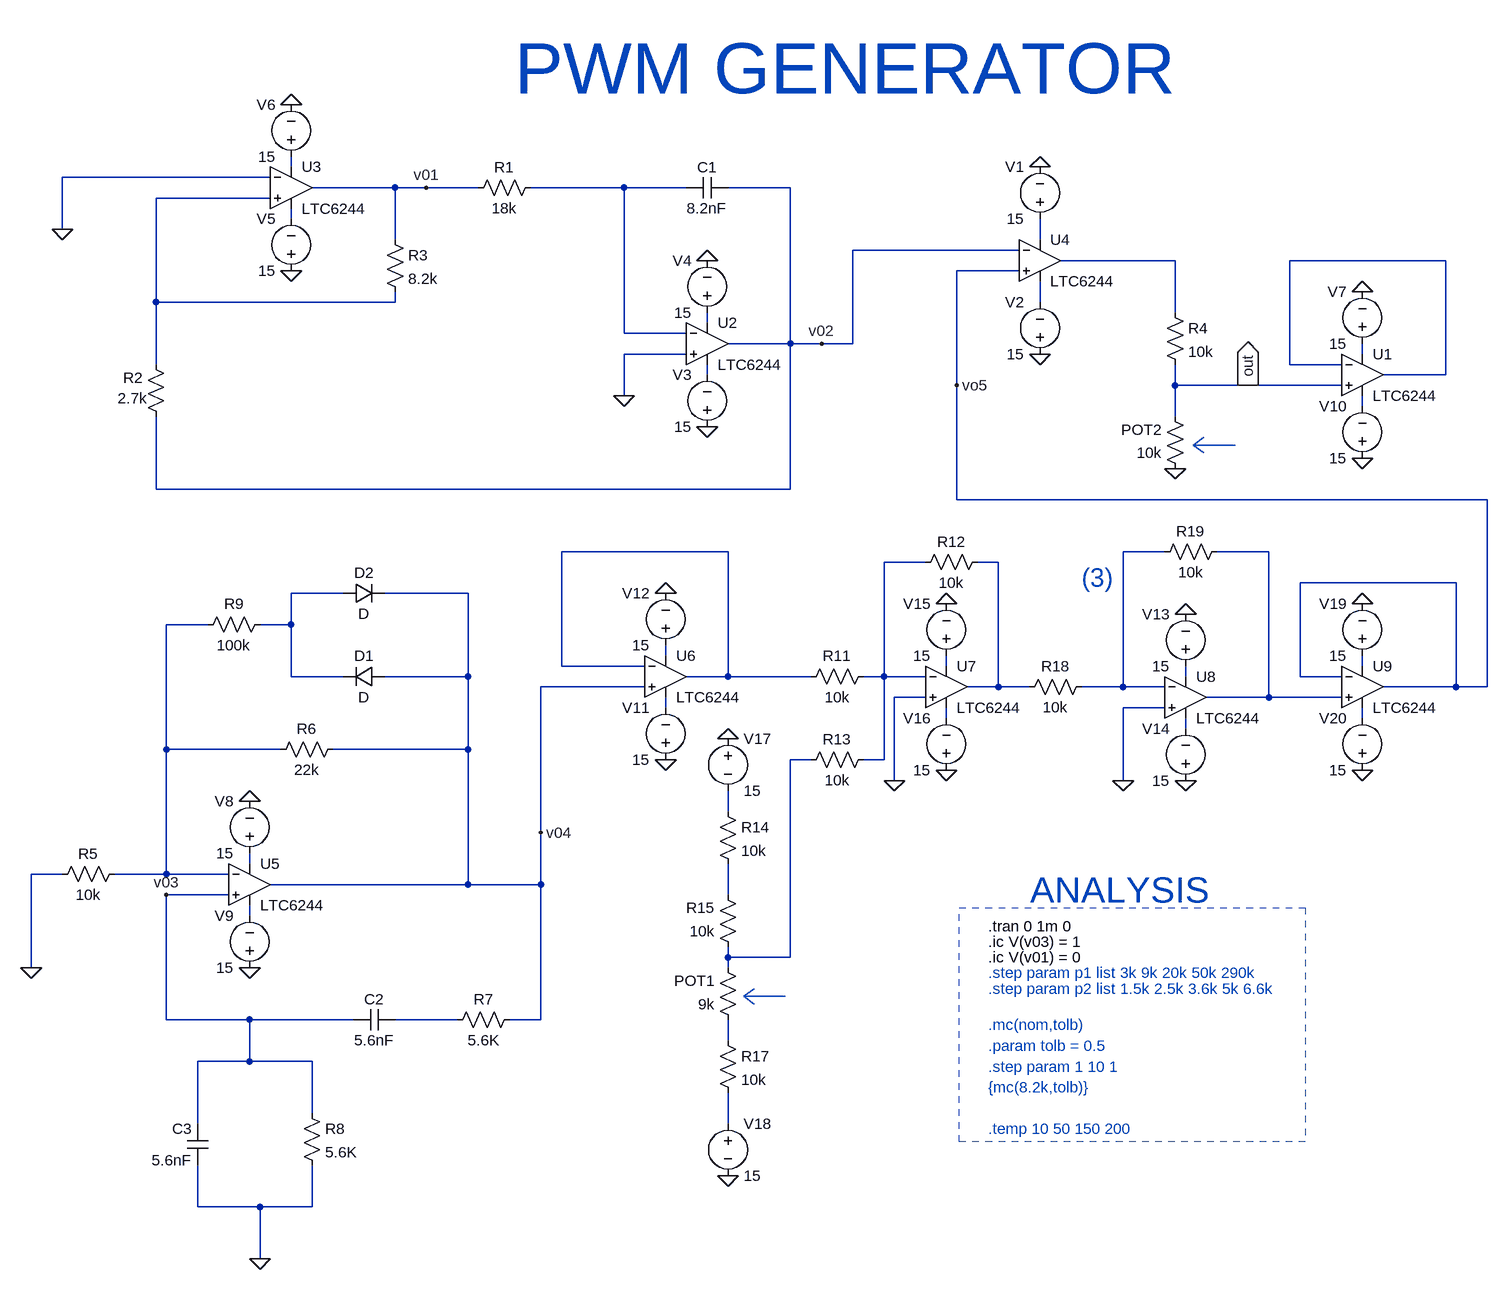
[diagram p0: schematic CAD_project_Istrate_Andreea.asc]
CAD_project_Istrate_Andreea.asc, the LTspice schematic file:
Version 4
SHEET 1 3412 2608
WIRE 352 -144 352 -160
WIRE 320 -128 0 -128
WIRE 512 -112 384 -112
WIRE 560 -112 512 -112
WIRE 640 -112 560 -112
WIRE 864 -112 720 -112
WIRE 960 -112 864 -112
WIRE 1120 -112 1024 -112
WIRE 320 -96 144 -96
WIRE 352 -64 352 -80
WIRE 0 -48 0 -128
WIRE 512 -32 512 -112
WIRE 1504 -32 1504 -64
WIRE 1472 -16 1216 -16
WIRE 1712 0 1536 0
WIRE 2128 0 1888 0
WIRE 1472 16 1376 16
WIRE 144 64 144 -96
WIRE 512 64 512 48
WIRE 512 64 144 64
WIRE 1504 64 1504 32
WIRE 1712 80 1712 0
WIRE 992 96 992 80
WIRE 864 112 864 -112
WIRE 960 112 864 112
WIRE 1120 128 1120 -112
WIRE 1120 128 1024 128
WIRE 1168 128 1120 128
WIRE 1216 128 1216 -16
WIRE 1216 128 1168 128
WIRE 960 144 864 144
WIRE 2000 144 2000 128
WIRE 144 160 144 64
WIRE 1888 160 1888 0
WIRE 1968 160 1888 160
WIRE 992 176 992 160
WIRE 2128 176 2128 0
WIRE 2128 176 2032 176
WIRE 1376 192 1376 16
WIRE 1712 192 1712 160
WIRE 1824 192 1712 192
WIRE 1968 192 1824 192
WIRE 864 208 864 144
WIRE 2000 224 2000 208
WIRE 1712 240 1712 192
WIRE 144 352 144 240
WIRE 1120 352 1120 128
WIRE 1120 352 144 352
WIRE 1376 368 1376 192
WIRE 2192 368 1376 368
WIRE 1024 448 768 448
WIRE 1696 448 1632 448
WIRE 1856 448 1776 448
WIRE 1328 464 1264 464
WIRE 1440 464 1408 464
WIRE 2144 496 1904 496
WIRE 432 512 352 512
WIRE 624 512 496 512
WIRE 224 560 160 560
WIRE 352 560 352 512
WIRE 352 560 304 560
WIRE 928 608 928 592
WIRE 768 624 768 448
WIRE 896 624 768 624
WIRE 1360 624 1360 608
WIRE 2000 624 2000 608
WIRE 352 640 352 560
WIRE 432 640 352 640
WIRE 624 640 624 512
WIRE 624 640 496 640
WIRE 1024 640 1024 448
WIRE 1024 640 960 640
WIRE 1152 640 1024 640
WIRE 1264 640 1264 464
WIRE 1264 640 1232 640
WIRE 1328 640 1264 640
WIRE 1728 640 1728 624
WIRE 1904 640 1904 496
WIRE 1968 640 1904 640
WIRE 896 656 736 656
WIRE 1440 656 1440 464
WIRE 1440 656 1392 656
WIRE 1488 656 1440 656
WIRE 1632 656 1632 448
WIRE 1632 656 1568 656
WIRE 1696 656 1632 656
WIRE 2144 656 2144 496
WIRE 2144 656 2032 656
WIRE 2192 656 2192 368
WIRE 2192 656 2144 656
WIRE 1328 672 1280 672
WIRE 1856 672 1856 448
WIRE 1856 672 1760 672
WIRE 1968 672 1856 672
WIRE 928 688 928 672
WIRE 1696 688 1632 688
WIRE 1360 704 1360 688
WIRE 2000 704 2000 688
WIRE 1728 720 1728 704
WIRE 160 752 160 560
WIRE 336 752 160 752
WIRE 624 752 624 640
WIRE 624 752 416 752
WIRE 1152 768 1120 768
WIRE 1264 768 1264 640
WIRE 1264 768 1232 768
WIRE 1280 800 1280 672
WIRE 1632 800 1632 688
WIRE 1024 848 1024 816
WIRE 736 880 736 656
WIRE 288 928 288 912
WIRE 0 944 -48 944
WIRE 160 944 160 752
WIRE 160 944 80 944
WIRE 256 944 160 944
WIRE 624 960 624 752
WIRE 624 960 320 960
WIRE 736 960 736 880
WIRE 736 960 624 960
WIRE 256 976 160 976
WIRE 1024 976 1024 928
WIRE 288 1008 288 992
WIRE 1024 1072 1024 1056
WIRE 1120 1072 1120 768
WIRE 1120 1072 1024 1072
WIRE -48 1088 -48 944
WIRE 1024 1088 1024 1072
WIRE 160 1168 160 976
WIRE 288 1168 160 1168
WIRE 448 1168 288 1168
WIRE 608 1168 512 1168
WIRE 736 1168 736 960
WIRE 736 1168 688 1168
WIRE 1024 1200 1024 1168
WIRE 288 1232 288 1168
WIRE 288 1232 208 1232
WIRE 384 1232 288 1232
WIRE 384 1312 384 1232
WIRE 208 1328 208 1232
WIRE 1024 1328 1024 1280
WIRE 208 1456 208 1392
WIRE 304 1456 208 1456
WIRE 384 1456 384 1392
WIRE 384 1456 304 1456
WIRE 304 1536 304 1456
FLAG 1504 144 0
FLAG 1504 -144 0
FLAG 1824 192 out
IOPIN 1824 192 Out
FLAG 304 1536 0
FLAG -48 1088 0
FLAG 288 1088 0
FLAG 288 832 0
FLAG 0 -48 0
FLAG 352 16 0
FLAG 352 -240 0
FLAG 992 0 0
FLAG 992 256 0
FLAG 1712 320 0
FLAG 560 -112 v01
FLAG 2000 304 0
FLAG 2000 48 0
FLAG 928 768 0
FLAG 928 512 0
FLAG 1360 784 0
FLAG 1360 528 0
FLAG 1728 800 0
FLAG 1728 544 0
FLAG 1632 800 0
FLAG 1280 800 0
FLAG 1024 1408 0
FLAG 1024 736 0
FLAG 2000 784 0
FLAG 2000 528 0
FLAG 864 208 0
FLAG 160 976 v03
FLAG 1168 128 v02
FLAG 736 880 v04
FLAG 1376 192 vo5
SYMBOL voltage 1504 -48 R180
WINDOW 0 24 96 Left 2
WINDOW 3 24 16 Left 2
SYMATTR InstName V1
SYMATTR Value 15
SYMBOL voltage 1504 160 R180
WINDOW 0 24 96 Left 2
WINDOW 3 24 16 Left 2
SYMATTR InstName V2
SYMATTR Value 15
SYMBOL Voltage 288 928 R180
WINDOW 0 24 96 Left 2
WINDOW 3 24 16 Left 2
SYMATTR InstName V8
SYMATTR Value 15
SYMBOL Voltage 288 1104 R180
WINDOW 0 24 96 Left 2
WINDOW 3 24 16 Left 2
SYMATTR InstName V9
SYMATTR Value 15
SYMBOL Res 96 928 R90
WINDOW 0 0 56 VBottom 2
WINDOW 3 32 56 VTop 2
SYMATTR InstName R5
SYMATTR Value 10k
SYMBOL Res 432 736 R90
WINDOW 0 0 56 VBottom 2
WINDOW 3 32 56 VTop 2
SYMATTR InstName R6
SYMATTR Value 22k
SYMBOL Res 704 1152 R90
WINDOW 0 0 56 VBottom 2
WINDOW 3 32 56 VTop 2
SYMATTR InstName R7
SYMATTR Value 5.6K
SYMBOL Cap 512 1152 R90
WINDOW 0 0 32 VBottom 2
WINDOW 3 32 32 VTop 2
SYMATTR InstName C2
SYMATTR Value 5.6nF
SYMBOL Cap 224 1328 M0
SYMATTR InstName C3
SYMATTR Value 5.6nF
SYMBOL Res 368 1296 R0
SYMATTR InstName R8
SYMATTR Value 5.6K
SYMBOL Voltage 992 272 R180
WINDOW 0 24 96 Left 2
WINDOW 3 24 16 Left 2
SYMATTR InstName V3
SYMATTR Value 15
SYMBOL Voltage 992 96 R180
WINDOW 0 24 96 Left 2
WINDOW 3 24 16 Left 2
SYMATTR InstName V4
SYMATTR Value 15
SYMBOL Voltage 352 32 R180
WINDOW 0 24 96 Left 2
WINDOW 3 24 16 Left 2
SYMATTR InstName V5
SYMATTR Value 15
SYMBOL Voltage 352 -144 R180
WINDOW 0 24 96 Left 2
WINDOW 3 24 16 Left 2
SYMATTR InstName V6
SYMATTR Value 15
SYMBOL Res 160 256 R180
WINDOW 0 36 76 Left 2
WINDOW 3 29 44 Left 2
SYMATTR InstName R2
SYMATTR Value 2.7k
SYMBOL Res 496 -48 R0
SYMATTR InstName R3
SYMATTR Value 8.2k
SYMBOL Cap 1024 -128 R90
WINDOW 0 0 32 VBottom 2
WINDOW 3 32 32 VTop 2
SYMATTR InstName C1
SYMATTR Value 8.2nF
SYMBOL Res 1728 336 R180
WINDOW 0 36 76 Left 2
WINDOW 3 36 40 Left 2
SYMATTR InstName POT2
SYMATTR Value 10k
SYMBOL Res 1696 64 R0
SYMATTR InstName R4
SYMATTR Value 10k
SYMBOL Opamps/LTC6244 992 128 R0
SYMATTR InstName U2
SYMBOL Opamps/LTC6244 352 -112 R0
SYMATTR InstName U3
SYMBOL Opamps/LTC6244 1504 0 R0
SYMATTR InstName U4
SYMBOL Res 320 544 R90
WINDOW 0 0 56 VBottom 2
WINDOW 3 32 56 VTop 2
SYMATTR InstName R9
SYMATTR Value 100k
SYMBOL Diode 496 624 R90
WINDOW 0 0 32 VBottom 2
WINDOW 3 32 32 VTop 2
SYMATTR InstName D1
SYMBOL Diode 432 528 R270
WINDOW 0 32 32 VTop 2
WINDOW 3 0 32 VBottom 2
SYMATTR InstName D2
SYMBOL Opamps/LTC6244 288 960 R0
SYMATTR InstName U5
SYMBOL Opamps/LTC6244 2000 176 R0
SYMATTR InstName U1
SYMBOL Voltage 2000 144 R180
WINDOW 0 24 96 Left 2
WINDOW 3 24 16 Left 2
SYMATTR InstName V7
SYMATTR Value 15
SYMBOL Voltage 2000 320 R180
WINDOW 0 24 96 Left 2
WINDOW 3 24 16 Left 2
SYMATTR InstName V10
SYMATTR Value 15
SYMBOL Opamps/LTC6244 928 640 R0
SYMATTR InstName U6
SYMBOL Opamps/LTC6244 1360 656 R0
SYMATTR InstName U7
SYMBOL Opamps/LTC6244 1728 672 R0
SYMATTR InstName U8
SYMBOL Voltage 928 784 R180
WINDOW 0 24 96 Left 2
WINDOW 3 24 16 Left 2
SYMATTR InstName V11
SYMATTR Value 15
SYMBOL Voltage 928 608 R180
WINDOW 0 24 96 Left 2
WINDOW 3 24 16 Left 2
SYMATTR InstName V12
SYMATTR Value 15
SYMBOL Voltage 1728 640 R180
WINDOW 0 24 96 Left 2
WINDOW 3 24 16 Left 2
SYMATTR InstName V13
SYMATTR Value 15
SYMBOL Voltage 1728 816 R180
WINDOW 0 24 96 Left 2
WINDOW 3 24 16 Left 2
SYMATTR InstName V14
SYMATTR Value 15
SYMBOL Voltage 1360 624 R180
WINDOW 0 24 96 Left 2
WINDOW 3 24 16 Left 2
SYMATTR InstName V15
SYMATTR Value 15
SYMBOL Voltage 1360 800 R180
WINDOW 0 24 96 Left 2
WINDOW 3 24 16 Left 2
SYMATTR InstName V16
SYMATTR Value 15
SYMBOL Res 1248 624 R90
WINDOW 0 0 56 VBottom 2
WINDOW 3 32 56 VTop 2
SYMATTR InstName R11
SYMATTR Value 10k
SYMBOL Res 1424 448 R90
WINDOW 0 0 56 VBottom 2
WINDOW 3 32 56 VTop 2
SYMATTR InstName R12
SYMATTR Value 10k
SYMBOL Res 1248 752 R90
WINDOW 0 0 56 VBottom 2
WINDOW 3 32 56 VTop 2
SYMATTR InstName R13
SYMATTR Value 10k
SYMBOL Res 1040 1072 R180
WINDOW 0 36 76 Left 2
WINDOW 3 36 40 Left 2
SYMATTR InstName R15
SYMATTR Value 10k
SYMBOL Res 1040 1184 R180
WINDOW 0 36 76 Left 2
WINDOW 3 36 40 Left 2
SYMATTR InstName POT1
SYMATTR Value 9k
SYMBOL Voltage 1024 720 R0
SYMATTR InstName V17
SYMATTR Value 15
SYMBOL Voltage 1024 1312 R0
SYMATTR InstName V18
SYMATTR Value 15
SYMBOL Res 1584 640 R90
WINDOW 0 0 56 VBottom 2
WINDOW 3 32 56 VTop 2
SYMATTR InstName R18
SYMATTR Value 10k
SYMBOL Res 1792 432 R90
WINDOW 0 0 56 VBottom 2
WINDOW 3 32 56 VTop 2
SYMATTR InstName R19
SYMATTR Value 10k
SYMBOL Opamps/LTC6244 2000 656 R0
SYMATTR InstName U9
SYMBOL Voltage 2000 624 R180
WINDOW 0 24 96 Left 2
WINDOW 3 24 16 Left 2
SYMATTR InstName V19
SYMATTR Value 15
SYMBOL Voltage 2000 800 R180
WINDOW 0 24 96 Left 2
WINDOW 3 24 16 Left 2
SYMATTR InstName V20
SYMATTR Value 15
SYMBOL Res 1008 832 R0
SYMATTR InstName R14
SYMATTR Value 10k
SYMBOL Res 1008 1184 R0
SYMATTR InstName R17
SYMATTR Value 10k
SYMBOL Res 736 -128 R90
WINDOW 0 0 56 VBottom 2
WINDOW 3 32 56 VTop 2
SYMATTR InstName R1
SYMATTR Value 18k
TEXT 1424 1024 Left 2 !.tran 0 1m 0
TEXT 1760 968 Right 5 ;ANALYSIS
TEXT 1424 1120 Left 2 ;.step param p2 list 1.5k 2.5k 3.6k 5k 6.6k
TEXT 696 -296 Left 7 ;PWM GENERATOR
TEXT 1424 1176 Left 2 ;.mc(nom,tolb)
TEXT 1424 1208 Left 2 ;.param tolb = 0.5
TEXT 1424 1240 Left 2 ;.step param 1 10 1
TEXT 1424 1272 Left 2 ;{mc(8.2k,tolb)}
TEXT 1424 1336 Left 2 ;.temp 10 50 150 200
TEXT 1424 1048 Left 2 !.ic V(v03) = 1
TEXT 1424 1072 Left 2 !.ic V(v01) = 0
TEXT 1424 1096 Left 2 ;.step param p1 list 3k 9k 20k 50k 290k
TEXT 1568 488 Left 4 ;(3)
LINE Normal 1804 284 1740 284
LINE Normal 1756 272 1740 284
LINE Normal 1740 284 1756 296
LINE Normal 1112 1132 1048 1132
LINE Normal 1064 1120 1048 1132
LINE Normal 1048 1132 1064 1144
RECTANGLE Normal 1380 996 1912 1356 2

The netlist it stands for:
* CAD_project_Istrate_Andreea.asc
V1 N005 0 15
V2 0 N008 15
V8 N030 0 15
V9 0 N032 15
R5 N019 0 10k
R6 v04 N019 22k
R7 v04 N033 5.6K
C2 N033 v03 5.6nF
C3 v03 0 5.6nF
R8 v03 0 5.6K
V3 0 N011 15
V4 N009 0 15
V5 0 N004 15
V6 N001 0 15
R2 v02 N003 2.7k
R3 v01 N003 8.2k
C1 v02 N002 8.2nF
R§POT2 0 out 10k
R4 N006 out 10k
XU2 0 N002 N009 N011 v02 LTC6244  ; pins In+ In- V+ V- OUT
XU3 N003 0 N001 N004 v01 LTC6244  ; pins In+ In- V+ V- OUT
XU4 vo5 v02 N005 N008 N006 LTC6244  ; pins In+ In- V+ V- OUT
R9 N018 N019 100k
D1 v04 N018 D
D2 N018 v04 D
XU5 v03 N019 N030 N032 v04 LTC6244  ; pins In+ In- V+ V- OUT
XU1 out N007 N010 N012 N007 LTC6244  ; pins In+ In- V+ V- OUT
V7 N010 0 15
V10 0 N012 15
XU6 v04 N013 N020 N024 N013 LTC6244  ; pins In+ In- V+ V- OUT
XU7 0 N016 N021 N025 N017 LTC6244  ; pins In+ In- V+ V- OUT
XU8 0 N014 N023 N027 N015 LTC6244  ; pins In+ In- V+ V- OUT
V11 0 N024 15
V12 N020 0 15
V13 N023 0 15
V14 0 N027 15
V15 N021 0 15
V16 0 N025 15
R11 N016 N013 10k
R12 N017 N016 10k
R13 N016 N028 10k
R15 N028 N031 10k
R§POT1 N034 N028 9k
V17 0 N029 15
V18 N035 0 15
R18 N014 N017 10k
R19 N015 N014 10k
XU9 N015 vo5 N022 N026 vo5 LTC6244  ; pins In+ In- V+ V- OUT
V19 N022 0 15
V20 0 N026 15
R14 N029 N031 10k
R17 N034 N035 10k
R1 N002 v01 18k
.model D D
.lib standard.dio
.tran 0 1m 0
* ANALYSIS
* .step param p2 list 1.5k 2.5k 3.6k 5k 6.6k
* PWM GENERATOR
* .mc(nom,tolb)
* .param tolb = 0.5
* .step param 1 10 1
* {mc(8.2k,tolb)}
* .temp 10 50 150 200
.ic V(v03) = 1
.ic V(v01) = 0
* .step param p1 list 3k 9k 20k 50k 290k
* (3)
.backanno
.end